# EAGLE design passing-particles (EAGLE 9.6.2)
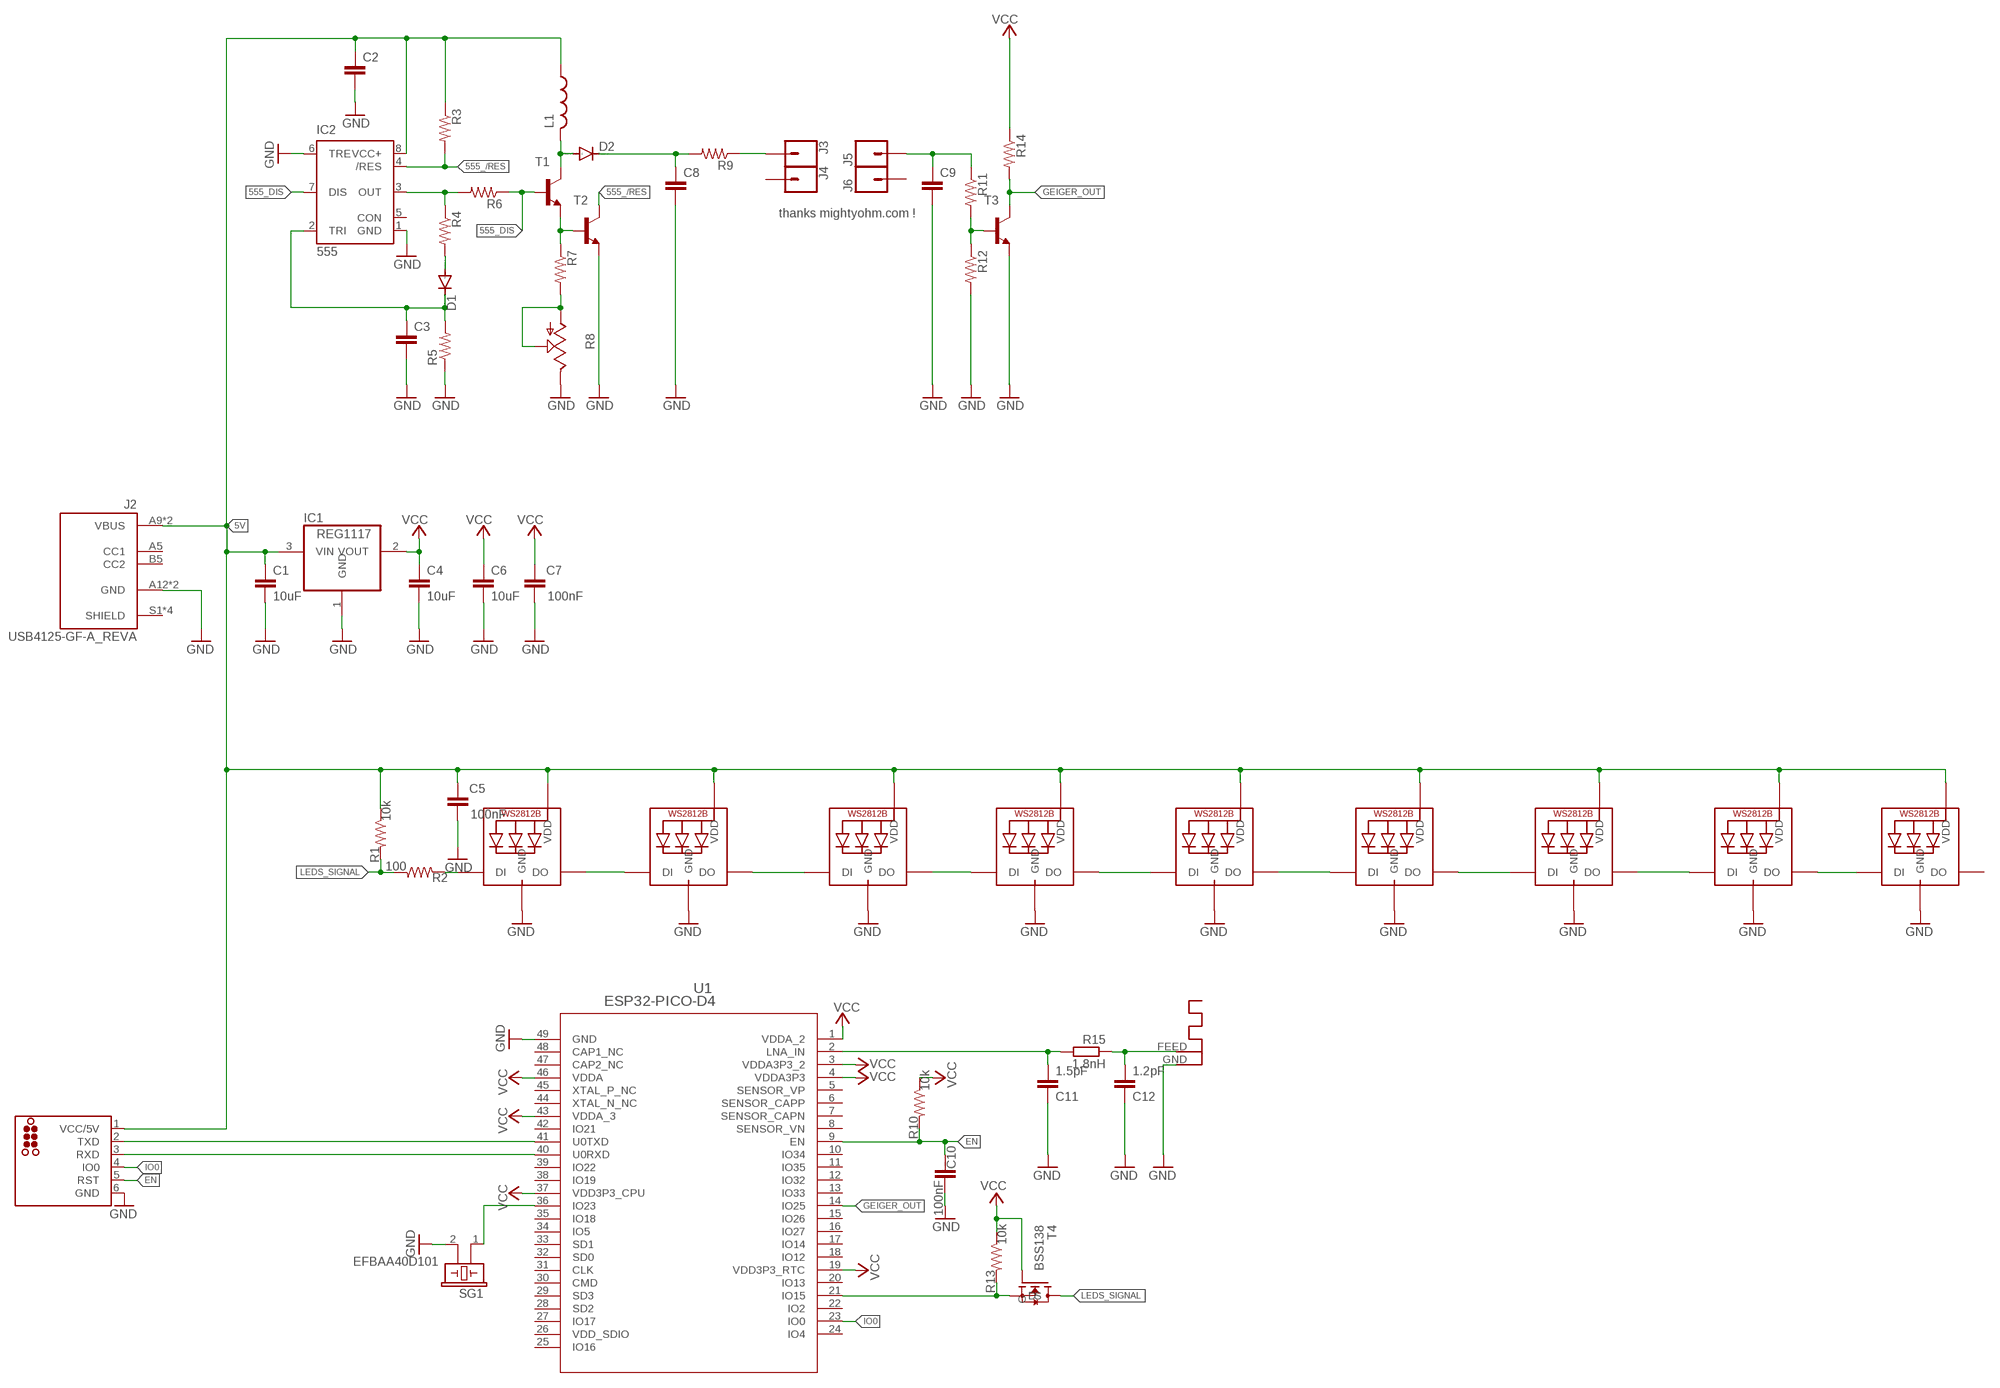
[diagram p0: schematic, sheet 1]

## Parts
ANT1  ANTENNA  [RN-ANT]
C1  10uF  C-EUC0805  [C0805]
C2  C-EUC0402  [C0402]
C3  C-EUC0402  [C0402]
C4  10uF  C-EUC0805  [C0805]
C5  100nF  C-EUC0402  [C0402]
C6  10uF  C-EUC0805  [C0805]
C7  100nF  C-EUC0402  [C0402]
C8  C-EUC0805  [C0805]
C9  C-EUC0402  [C0402]
C10  100nF  C-EUC0402  [C0402]
C11  1.5pF  C-EUC0402  [C0402]
C12  1.2pF  C-EUC0402  [C0402]
D1  DIODE-DO214AA  [DO214AA]
D2  DIODE-DO214AA  [DO214AA]
IC1  REG1117  [SOT223]
IC2  555  555D  [SO08]
J1  TC2030-ESP  [TC2030-MCP]
J2  USB4125-GF-A_REVA  [GCT_USB4125-GF-A_REVA]
J3  CONN_01  [1X01]
J4  CONN_01  [1X01]
J5  CONN_01  [1X01]
J6  CONN_01  [1X01]
L1  L-USL2012C  [L2012C]
LED1  WS2812B5050  [WS2812B]
LED2  WS2812B5050  [WS2812B]
LED3  WS2812B5050  [WS2812B]
LED4  WS2812B5050  [WS2812B]
LED5  WS2812B5050  [WS2812B]
LED6  WS2812B5050  [WS2812B]
LED7  WS2812B5050  [WS2812B]
LED8  WS2812B5050  [WS2812B]
LED9  WS2812B5050  [WS2812B]
R1  10k  R-US_R0402  [R0402]
R2  100  R-US_R0402  [R0402]
R3  R-US_R0402  [R0402]
R4  R-US_R0402  [R0402]
R5  R-US_R0402  [R0402]
R6  R-US_R0402  [R0402]
R7  R-US_R0402  [R0402]
R8  TRIM_US-SM-42/43B  [SM-42/43B]
R9  R-US_R0402  [R0402]
R10  10k  R-US_R0402  [R0402]
R11  R-US_R0402  [R0402]
R12  R-US_R0402  [R0402]
R13  10k  R-US_R0402  [R0402]
R14  R-US_R0402  [R0402]
R15  1.8nH  R-EU_R0402  [R0402]
SG1  EFBAA40D101  [EFBAA40D101]
T1  BC817-NPN-SOT23-BEC  [SOT23-BEC]
T2  BC817-NPN-SOT23-BEC  [SOT23-BEC]
T3  BC817-NPN-SOT23-BEC  [SOT23-BEC]
T4  BSS138  [BSS138]
U1  ESP32-PICO-D4  [ESP32-PICO-D4_EXP]

## Nets
5V: C1.1 C2.1 C5.1 IC1.3(VIN) IC2.8(VCC+) J1.1(VCC/5V) J2.A9(VBUS) J2.B9(VBUS) L1.1 LED1.1-VDD(VDD) LED2.1-VDD(VDD) LED3.1-VDD(VDD) LED4.1-VDD(VDD) LED5.1-VDD(VDD) LED6.1-VDD(VDD) LED7.1-VDD(VDD) LED8.1-VDD(VDD) LED9.1-VDD(VDD) R1.1 R3.1
555_/RES: IC2.4(/RES) R3.2 T2.C
555_DIS: IC2.7(DIS) R6.1 T1.B
EN: C10.2 J1.5(RST) R10.2 U1.9(EN)
GEIGER_OUT: R14.2 T3.C U1.14(IO25)
GND: ANT1.GND C1.2 C2.2 C3.2 C4.2 C5.2 C6.2 C7.2 C8.2 C9.2 C10.1 C11.1 C12.1 IC1.1(GND) IC2.1(GND) IC2.6(TRE) J1.6(GND) J2.A12(GND) J2.B12(GND) LED1.3-GND(GND) LED2.3-GND(GND) LED3.3-GND(GND) LED4.3-GND(GND) LED5.3-GND(GND) LED6.3-GND(GND) LED7.3-GND(GND) LED8.3-GND(GND) LED9.3-GND(GND) R5.1 R8.3(E) R12.2 SG1.2 T2.E T3.E U1.49(GND)
IO0: J1.4(IO0) U1.23(IO0)
LEDS_SIGNAL: R1.2 R2.1 T4.D
N$1: IC2.3(OUT) R4.1 R6.2
N$2: D1.A R4.2
N$3: C3.1 D1.C IC2.2(TRI) R5.2
N$4: R7.1 T1.E T2.B
N$5: D2.A L1.2 T1.C
N$6: R7.2 R8.1(A) R8.2(S)
N$7: C8.1 D2.C R9.2
N$8: J3.1 R9.1
N$9: C9.1 J5.1 R11.1
N$10: R11.2 R12.1 T3.B
N$11: ANT1.FEED C12.2 R15.1
N$12: LED1.2-DOUT(DO) LED2.4-DIN(DI)
N$13: C11.2 R15.2 U1.2(LNA_IN)
N$14: J1.2(TXD) U1.41(U0TXD)
N$15: LED2.2-DOUT(DO) LED3.4-DIN(DI)
N$16: LED3.2-DOUT(DO) LED4.4-DIN(DI)
N$17: LED4.2-DOUT(DO) LED5.4-DIN(DI)
N$18: LED5.2-DOUT(DO) LED6.4-DIN(DI)
N$19: LED6.2-DOUT(DO) LED7.4-DIN(DI)
N$20: LED7.2-DOUT(DO) LED8.4-DIN(DI)
N$21: LED8.2-DOUT(DO) LED9.4-DIN(DI)
N$22: R13.2 T4.S U1.21(IO15)
N$23: SG1.1 U1.36(IO23)
N$24: LED1.4-DIN(DI) R2.2
N$27: J1.3(RXD) U1.40(U0RXD)
VCC: C4.1 C6.1 C7.1 IC1.2(VOUT) R10.1 R13.1 R14.1 T4.G U1.1(VDDA_2) U1.3(VDDA3P3_2) U1.4(VDDA3P3) U1.19(VDD3P3_RTC) U1.37(VDD3P3_CPU) U1.43(VDDA_3) U1.46(VDDA)
Unconnected: IC2.5(CON) J2.A5(CC1) J2.B5(CC2) J2.S1(SHIELD) J2.S2(SHIELD) J2.S3(SHIELD) J2.S4(SHIELD) J4.1 J6.1 LED9.2-DOUT(DO) U1.5(SENSOR_VP) U1.6(SENSOR_CAPP) U1.7(SENSOR_CAPN) U1.8(SENSOR_VN) U1.10(IO34) U1.11(IO35) U1.12(IO32) U1.13(IO33) U1.15(IO26) U1.16(IO27) U1.17(IO14) U1.18(IO12) U1.20(IO13) U1.22(IO2) U1.24(IO4) U1.25(IO16) U1.27(IO17) U1.28(SD2) U1.29(SD3) U1.30(CMD) U1.31(CLK) U1.32(SD0) U1.33(SD1) U1.34(IO5) U1.35(IO18) U1.38(IO19) U1.39(IO22) U1.42(IO21) U1.44(XTAL_N_NC) U1.45(XTAL_P_NC) U1.47(CAP2_NC) U1.48(CAP1_NC)

## Notes on the sheet
- thanks mightyohm.com !

## Power pins joined to a net without a drawn wire
VDD_SDIO: U1.26(VDD_SDIO)

## Library data of the parts
ANT1 = adafruit:ANTENNA
C1-C12 = rcl:C-EU: CAPACITOR, European symbol; SPICEPREFIX: C
D1 D2 = diode:DIODE-: DIODE
IC1 = burr-brown:REG1117: 800mA and 1A Low Dropout (LDO) Positive Regulator 1.8V, 2.5V, 2.85V, 3.3V, 5V, and Adj; MPN: REG1117; OC_FARNELL: 1097566; OC_NEWARK: 14P6981
IC2 = SparkFun-IC-Special-Function:555: General purpose bipolar Timer Datasheet <http://www.sparkfun.com/datasheets/Components/General/ne555.pdf> SparkFun Products SparkFun SparkPunk Sequencer Kit <https://www.sparkfun.com/products/12707> (KIT-12707) Storefront Component: 555 Timer <https://www.sparkfun.com/products/9273> (COM-09273) Two parts valid for production: VFP: IC-11930 (M7555 PTH) VFP: IC-09173 (555 PTH) - Preferred; PROD_ID: NA-XXXXX
J1 = tag-connect:TC2030-ESP
J2 = USB4125-GF-A_REVA:USB4125-GF-A_REVA: USB 2.0 Type C Receptacle, Horizontal, SMT, For Power charging; DESCRIPTION: USB Charge Only Connector Type C Horizontal Receptacle, 3.16mm profile, 6 Pins, Surface mount, Top mount, low cost; MF: Global Connector Technology; MP: USB4125-GF-A; PACKAGE: None; PURCHASE-URL: https://pricing.snapeda.com/search/part/USB4125-GF-A/?ref=eda
J3-J6 = SparkFun-Connectors:CONN_01: Single connection point. Often used as Generic Header-pin footprint for 0.1 inch spaced/style header connections On any of the 0.1 inch spaced packages, you can populate with these: Break Away Headers - Straight <https://www.sparkfun.com/products/116> (PRT-00116) Break Away Male Headers - Right Angle <https://www.sparkfun.com/products/553> (PRT-00553) Female Headers <https://www.sparkfun.com/products/115> (PRT-00115) Break Away Headers - Machine Pin <https://www.sparkfun.com/products/117> (PRT-00117) Break Away Female Headers - Swiss Machine Pin <https://www.sparkfun.com/products/743> (PRT-00743) This device is also useful as a general connection point to wire up your design to another part of your project. Our various solder wires solder well into these plated through hole pads. Hook-Up Wire - Assortment (Stranded, 22 AWG) <https://www.sparkfun.com/products/11375> (PRT-11375) Hook-Up Wire - Assortment (Solid Core, 22 AWG) <https://www.sparkfun.com/products/11367> (PRT-11367) View the entire wire category on our website here <https://www.sparkfun.com/categories/141> Special notes: SMTSO-256-ET is a "flush mount" nut for a 4-40 screw. We mostly use this on specialty testbeds; it is a nice way to connect hardware to your PCB at an adjustable hieght. Also note, the SNAP packages are for using a snappable style connector. We sell a baggie of snaps and they are also used on two LilyPad designs: Snap Assortment - 30 pack (male and female) <https://www.sparkfun.com/products/11347> (DEV-11347) LilyPad Arduino SimpleSnap <https://www.sparkfun.com/products/10941> (DEV-10941) LilyPad SimpleSnap Protoboard <https://www.sparkfun.com/products/10940> (DEV-10940)
L1 = rcl:L-US: INDUCTOR, American symbol; SPICEPREFIX: L
LED1-LED9 = adafruit:WS2812B
R1-R7 R9-R14 = rcl:R-US_: RESISTOR, American symbol; SPICEPREFIX: R
R8 = pot:TRIM_US-: POTENTIOMETER
R15 = rcl:R-EU_: RESISTOR, European symbol; SPICEPREFIX: L
SG1 = buzzer:EFB?: Piezoelectric Acoustic Transducer Source: Panbasonic .. 2SC1685.pdf; OC_FARNELL: unknown; OC_NEWARK: unknown
T1-T3 = transistor-neu-to92:*-NPN-: NPN Transistror
T4 = BSS138:BSS138: BSS138 N-Channel Logic Level Enhancement Mode Field Effect Transistor; AVAILABILITY: Unavailable; DESCRIPTION: N-Channel 50V 220mA (Ta) 360mW (Ta) Surface Mount SOT-23-3; MF: MICROSS/On Semiconductor; MP: BSS138; PACKAGE: TO-236-3 Micross; PRICE: None
U1 = esp32picod4:ESP32-PICO-D4; BUILT_BY: EMA_Cory; COPYRIGHT: Copyright (C) 2018 Accelerated Designs. All rights reserved; DATASHEET: https://www.espressif.com/sites/default/files/documentation/esp32-pico-d4_datasheet_en.pdf; MANUFACTURER_PART_NUMBER: ESP32-PICO-D4; SOURCELIBRARY: Espressif_Systems_2020-04-10; VENDOR: Espressif Systems

## Board
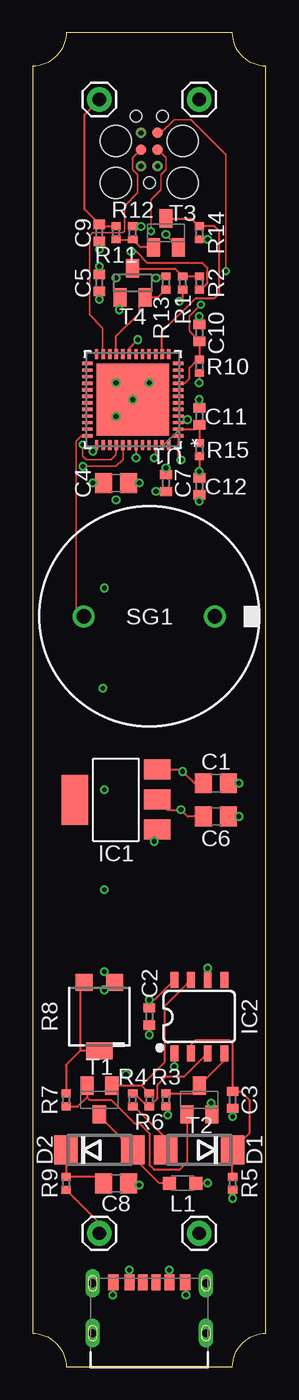
[diagram p1: board, top side]
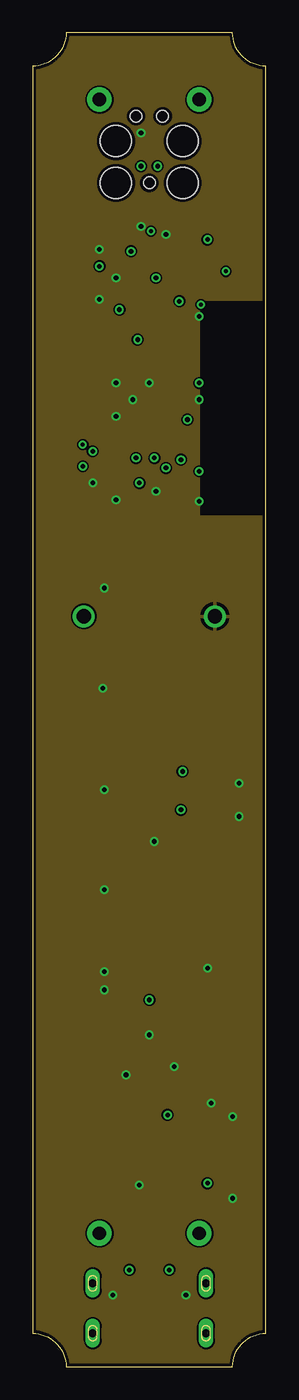
[diagram p2: board, inner layer Route2]
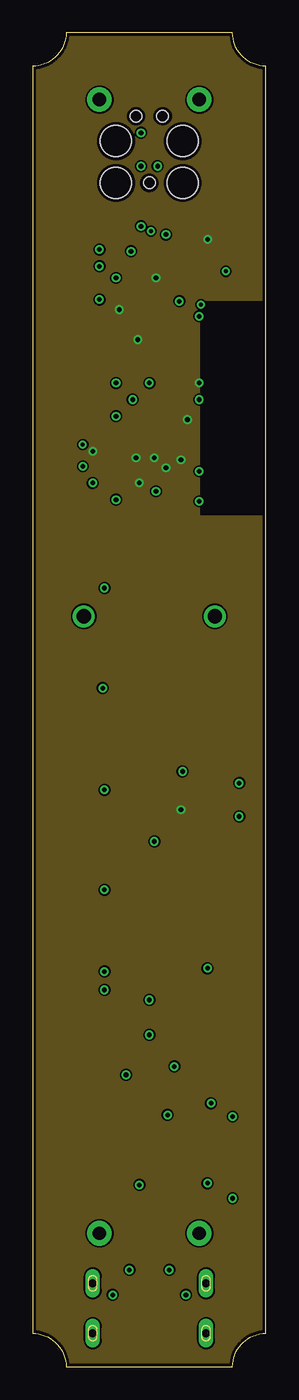
[diagram p3: board, inner layer Route15]
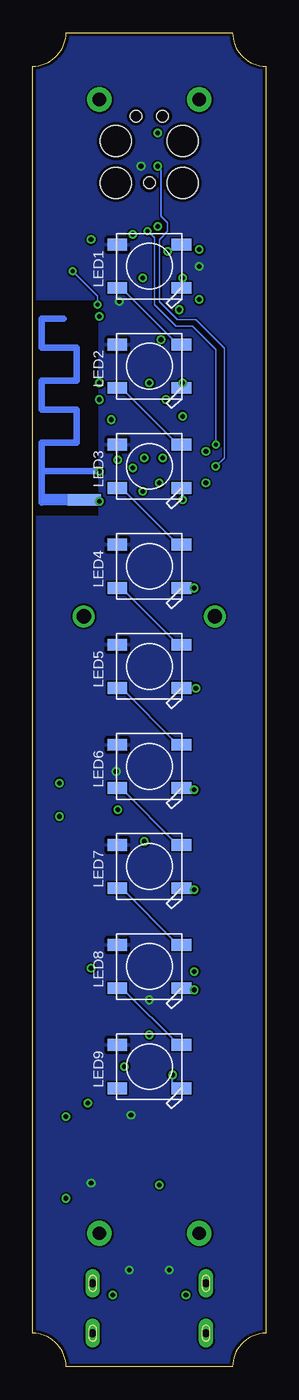
[diagram p4: board, bottom side, seen from below]

Size 17.78 x 101.6 mm. Coordinates in mm from the lower left corner, seen from the top.
Outline: 2.54,0 15.24,0 arc-90 17.78,2.54 17.78,64.77 17.78,81.28 17.78,99.06 arc-90 15.24,101.6 2.54,101.6 arc-90 0,99.06 0,2.54 arc-90 2.54,0
Copper layers (1*2*15*16): Top 0.035mm / dielectric 0.23mm / Route2 0.035mm / dielectric 0.93mm / Route15 0.035mm / dielectric 0.23mm / Bottom 0.035mm
Design rules "MF_Standard_4_Layer": minimum track width 5mil, minimum drill 12mil, track to track 5mil, track to pad 5mil, pad to pad 5mil, via to via 5mil, smd to smd 0mil, copper to edge 10mil, drill to drill 10mil, minimum pad ring 6mil, minimum via ring 6mil, stop-mask expansion 2mil, vias tented up to drill 25mil, thermal gap 10mil

### Footprints (pad centres in the part's own frame; a part is rotated, then mirrored left to right if it is on the bottom)
RN-ANT = smd 0.025 x 0.025: FEED 0,2.159 | smd 2.54 x 0.889: GND -1.143,0
C0805 = smd 1.3 x 1.5: 1 -0.95,0; 2 0.95,0
C0402 = smd 0.7 x 0.9: 1 -0.65,0; 2 0.65,0
DO214AA = smd 1.8 x 2.2: A 2.55,0; C -2.55,0
SOT223 = smd 1.499 x 2.007: 1 -2.261,-3.15; 2 0.025,-3.15; 3 2.311,-3.15 | smd 3.81 x 2.007: 4 0,3.15
SO08 = smd 0.6 x 1.2: 1 -1.905,-2.8; 2 -0.635,-2.8; 3 0.635,-2.8; 4 1.905,-2.8; 5 1.905,2.8; 6 0.635,2.8; 7 -0.635,2.8; 8 -1.905,2.8
TC2030-MCP = smd 0.787 x 0.787: 1 1.27,-0.635; 2 1.27,0.635; 3 2.54,-0.635; 4 2.54,0.635; 5 3.81,-0.635; 6 3.81,0.635 | hole 0.889: 0,0; 5.08,-1.016; 5.08,1.016 | hole 2.375: 0,2.54; 0,-2.54; 3.175,-2.54; 3.175,2.54
GCT_USB4125-GF-A_REVA = smd 0.7 x 1.2: A5 -0.5,0.08; B5 0.5,0.08 | smd 0.76 x 1.2: A9 1.52,0.08; B9 -1.52,0.08 | smd 0.8 x 1.2: A12 2.75,0.08; B12 -2.75,0.08 | drill 0.6 pad 1.1 long: S1 -4.32,0; S2 4.32,0; S3 -4.32,-3.8; S4 4.32,-3.8
1X01 = drill 1.016 pad 1.88: 1 0,0
L2012C = smd 1 x 1: 1 -1,0; 2 1,0
WS2812B = smd 1.5 x 0.9: 1-VDD 2.45,-1.65; 2-DOUT 2.45,1.65; 3-GND -2.45,1.65; 4-DIN -2.45,-1.65
R0402 = smd 0.6 x 0.7: 1 -0.5,0; 2 0.5,0
SM-42/43B = smd 1.3 x 1.3: 1 2.6,1.15; 3 2.6,-1.15 | smd 1.3 x 2: 2 -2.6,0
EFBAA40D101 = drill 1.1 pad 1.676: 1 -5,0; 2 5,0
SOT23-BEC = smd 1 x 1.4: B -0.95,-1.1; C 0,1.1; E 0.95,-1.1
BSS138 = smd 1 x 1.4: D 0,1.1; G -0.95,-1.1; S 0.95,-1.1
ESP32-PICO-D4_EXP = smd 0.787 x 0.254: 1 -3.467,2.75; 2 -3.467,2.25; 3 -3.467,1.75; 4 -3.467,1.25; 5 -3.467,0.75; 6 -3.467,0.25; 7 -3.467,-0.25; 8 -3.467,-0.75; 9 -3.467,-1.25; 10 -3.467,-1.75; 11 -3.467,-2.25; 12 -3.467,-2.75; 25 3.467,-2.75; 26 3.467,-2.25; 27 3.467,-1.75; 28 3.467,-1.25; 29 3.467,-0.75; 30 3.467,-0.25; 31 3.467,0.25; 32 3.467,0.75; 33 3.467,1.25; 34 3.467,1.75; 35 3.467,2.25; 36 3.467,2.75 | smd 0.254 x 0.787: 13 -2.75,-3.467; 14 -2.25,-3.467; 15 -1.75,-3.467; 16 -1.25,-3.467; 17 -0.75,-3.467; 18 -0.25,-3.467; 19 0.25,-3.467; 20 0.75,-3.467; 21 1.25,-3.467; 22 1.75,-3.467; 23 2.25,-3.467; 24 2.75,-3.467; 37 2.75,3.467; 38 2.25,3.467; 39 1.75,3.467; 40 1.25,3.467; 41 0.75,3.467; 42 0.25,3.467; 43 -0.25,3.467; 44 -0.75,3.467; 45 -1.25,3.467; 46 -1.75,3.467; 47 -2.25,3.467; 48 -2.75,3.467 | smd 5.512 x 5.512: 49 0,0

### Placement (x,y rotation side)
ANT1  12.7,66.04 0 bottom
C1  13.97,44.45 0 top
C2  8.89,26.67 270 top
C3  15.24,20.32 270 top
C4  6.35,67.31 180 top
C5  5.08,82.55 270 top
C6  13.97,41.91 0 top
C7  10.16,67.31 270 top
C8  6.35,13.97 0 top
C9  5.08,86.36 270 top
C10  12.7,78.74 270 top
C11  12.7,72.39 270 top
C12  12.7,67.06 90 top
D1  12.7,16.51 180 top
D2  5.08,16.51 0 top
IC1  6.35,43.18 90 top
IC2  12.7,26.67 0 top
J1  8.89,90.17 90 top
J2  8.89,6.35 0 top
J3  5.08,10.16 270 top
J4  12.7,96.52 270 top
J5  5.08,96.52 270 top
J6  12.7,10.16 270 top
L1  11.43,13.97 180 top
LED1  8.89,83.82 180 bottom
LED2  8.89,76.2 180 bottom
LED3  8.89,68.58 180 bottom
LED4  8.89,60.96 180 bottom
LED5  8.89,53.34 180 bottom
LED6  8.89,45.72 180 bottom
LED7  8.89,38.1 180 bottom
LED8  8.89,30.48 180 bottom
LED9  8.89,22.86 180 bottom
R1  11.43,82.55 90 top
R2  12.7,82.55 270 top
R3  10.16,20.32 90 top
R4  7.62,20.32 270 top
R5  15.24,13.97 90 top
R6  8.89,20.32 270 top
R7  2.54,20.32 90 top
R8  5.08,26.67 90 top
R9  2.54,13.97 90 top
R10  12.7,76.2 90 top
R11  6.35,86.36 270 top
R12  7.62,86.36 90 top
R13  10.16,82.55 270 top
R14  12.7,86.36 90 top
R15  12.7,69.85 90 top
SG1  8.89,57.15 0 top
T1  5.08,20.32 180 top
T2  12.7,20.32 0 top
T3  10.16,86.36 0 top
T4  7.62,82.55 0 top
U1  7.62,73.66 180 top

### Tracks (layer width: path | path; a pad name or v marks a point on that pad's centre or on a via)
5V  (via drill 0.35)
  Top 0.152: C5.1 v5.08,83.82 | IC2.8 9.27,27.94 v8.89,27.94 C2.1 | R3.1 10.29,19.69 v10.29,19.18 | L1.1 v13.34,13.97 | J2.B9 v7.37,7.36 v7.37,7.37 | J2.A9 v10.41,7.36 v10.41,7.37 | IC1.3 11.28,45.49 v11.43,45.34 12.32,44.45 C1.1 | R1.1 11.43,81.41 v11.18,81.15
  other vias: 9.53,91.44
  pour Bottom: 0,0 17.78,0 17.78,64.77 12.7,64.77 12.7,81.28 17.78,81.28 17.78,86.36 17.78,101.6 0,101.6
555_/RES
  Top 0.152: IC2.4 14.61,23.32 T2.C 12.7,21.34 12.18,20.82 R3.2
555_DIS
  Top 0.152: T1.B 8.29,21.42 | 8.29,21.42 R6.1 | IC2.7 10.03,27.44 10.03,23.16 8.29,21.42
EN  (via drill 0.3)
  Top 0.127: J1.5 9.78,93.98 10.79,95 12.06,95 14.73,92.33 v14.73,83.44 | v12.83,80.9 11.94,80.01 11.94,78.87 12.7,78.11 C10.2
  Top 0.152: C10.2 R10.2 12.56,76.7 11.94,76.07 11.94,75.25 11.6,74.91 U1.9
  Bottom 0.127: v14.73,83.44 12.83,81.53 v12.83,80.9
GEIGER_OUT
  Top 0.152: T3.C 12.1,87.46 R14.2 | R14.2 | U1.14 9.87,78.83 12.45,81.41 13.84,81.41 14.22,81.79 14.22,86.49 13.85,86.86 R14.2
GND  (via drill 0.35)
  Top 0.152: v12.7,65.91 C12.1 | C11.1 v12.7,73.66 | C10.1 v12.7,80.01 | v8.26,86.87 R12.2 | C9.2 v5.08,85.09 | T3.E 11.11,85.28 v10.16,86.23 | C5.2 v5.08,81.28 | v8.89,74.93 U1.49 v6.35,72.39 | C4.2 v4.57,67.31 | C7.2 10.14,66.67 v9.4,66.67 | R8.3 5.46,30.04 v5.46,30.1 | IC2.6 v13.34,30.35 | C2.2 v8.89,25.27 | IC2.1 v10.79,22.86 | T2.E 13.65,20 v13.59,20.07 | C3.2 v15.24,19.05 | R5.1 v15.24,12.83 | J2.A12 11.64,5.5 v11.68,5.46 | J2.B12 6.14,5.5 v6.1,5.46 | C1.2 v15.75,44.45 | C6.2 v15.75,41.91 | IC1.1 9.5,40.23 v9.27,40.01 | C8.2 8,13.97 v8.13,13.84
  Bottom 0.152: ANT1.GND 12.83,66.04 v12.7,65.91 | LED1.3-GND 6.44,82.84 v6.35,82.93 | LED2.3-GND 6.35,74.64 v6.35,74.93 | LED4.3-GND v5.46,59.31 | LED5.3-GND v5.33,51.69 | LED6.3-GND 6.31,43.94 v5.46,43.94 | LED7.3-GND 5.59,36.45 v5.46,36.32 | LED8.3-GND 6.31,28.7 v5.46,28.7 | LED9.3-GND 6.82,21.21 7.11,21.5 v7.11,22.23 | LED3.3-GND 6.35,66.84 v6.35,66.04
  other vias: 8.26,93.98 7.62,73.66
  pour Route2: 0,0 17.78,0 17.78,64.77 12.7,64.77 12.7,81.28 17.78,81.28 17.78,86.36 17.78,105.41 0,105.41
IO0
  Top 0.127: J1.4 7.62,92.08 7.62,91.19 8,90.81 8,89.41 6.99,88.39 6.99,86.49 6.86,86.36 4.57,86.36 4.32,86.11 4.32,80.14 5.33,79.12 5.33,77.22 U1.23
LEDS_SIGNAL
  Top 0.152: R2.1 R1.2 10.83,83.65 T4.D
N$1
  Top 0.152: IC2.3 11.56,22.1 10.17,22.1 9.53,21.45 9.53,20.45 R6.2 8.75,19.82 7.75,20.82 R4.1
N$2
  Top 0.152: D1.A 10.15,17.41 7.74,19.82 R4.2
N$3
  Top 0.152: R5.2 D1.C 16.51,17.77 16.51,20.32 15.86,20.97 C3.1 15.24,24.64 14.99,24.89 12.45,24.89 12.06,24.51 IC2.2
N$4
  Top 0.152: R7.1 3.44,19.82 4.13,20.51 | T1.E 4.13,20.51 | T2.B 11.75,15.56 11.18,14.99 9.27,14.99 8.89,15.37 8.89,17.78 8.13,18.54 7.75,18.54 5.97,20.32 4.32,20.32 4.13,20.51
N$5
  Top 0.152: T1.C 5.08,19.06 D2.A 7.63,16 9.66,13.97 L1.2
N$6
  Top 0.152: R8.2 3.62,24.07 | 3.62,24.07 2.54,22.99 R7.2 | R8.1 3.62,28.96 3.62,24.07
N$7
  Top 0.152: D2.C R9.2 4.9,14.47 C8.1
N$8
  Top 0.152: R9.1 5.08,10.93 J3.1
N$9
  Top 0.152: R11.1 5.23,86.86 C9.1 3.94,88.15 3.94,95.38 J5.1
N$10
  Top 0.152: R11.2 R12.1 8.22,85.26 T3.B
N$11  (via drill 0.35)
  Top 0.152: R15.1 ANT1.FEED C12.2
  other vias: 12.7,68.2
N$12
  Bottom 0.152: LED2.4-DIN 6.69,77.85 11.01,82.17 LED1.2-DOUT
N$13
  Top 0.152: R15.2 C11.2 12.37,71.41 U1.2
N$14  (via drill 0.35)
  Top 0.127: v3.82,68.58 6.35,68.58 6.87,69.1 U1.41
  Bottom 0.127: J1.2 8,91.19 8,87.63 7.49,87.12 7.49,86.49 8.13,85.85 8.13,81.13 6.75,79.76 5.33,79.76 3.17,77.6 3.17,69.22 v3.82,68.58
  other vias: 8.26,91.44
N$15
  Bottom 0.152: LED3.4-DIN 6.69,70.23 11.01,74.55 LED2.2-DOUT
N$16
  Bottom 0.152: LED4.4-DIN 6.69,62.61 11.01,66.93 LED3.2-DOUT
N$17
  Bottom 0.152: LED5.4-DIN 6.69,54.99 11.01,59.31 LED4.2-DOUT
N$18
  Bottom 0.152: LED6.4-DIN 6.69,47.37 11.01,51.69 LED5.2-DOUT
N$19
  Bottom 0.152: LED6.2-DOUT 11.05,44.07 6.73,39.75 LED7.4-DIN
N$20
  Bottom 0.152: LED8.4-DIN 6.69,32.13 11.01,36.45 LED7.2-DOUT
N$21
  Bottom 0.152: LED9.4-DIN 6.64,24.51 10.96,28.83 LED8.2-DOUT
N$22
  Top 0.152: R13.2 9.56,81.45 T4.S 8.13,81.01 8.13,80.26 6.37,78.51 U1.21
N$23
  Top 0.127: U1.36 4.06,70.87 3.68,70.87 3.3,70.48 3.3,57.66 3.81,57.15 SG1.1
N$24  (via drill 0.35)
  Top 0.152: R2.2 12.84,82.05 13.34,82.55 13.34,83.69 12.95,84.07 8.76,84.07 7.87,84.96 v7.49,84.96
  Bottom 0.152: v7.49,84.96 7.24,84.96 6.73,85.47 LED1.4-DIN
N$27  (via drill 0.3)
  Top 0.127: v3.81,70.23 3.81,69.34 4.06,69.09 5.97,69.09 6.35,69.47 6.35,70.1 U1.40 | v9.02,86.49 9.02,88.9 9.78,89.66 9.78,90.81 10.16,91.19 10.16,92.08 J1.3
  Bottom 0.127: v3.81,70.23 3.81,77.47 5.59,79.25 6.86,79.25 8.51,80.9 8.51,85.98 v9.02,86.49
VCC  (via drill 0.35)
  Top 0.152: R10.1 v12.7,74.93 | R14.1 13.33,85.86 v13.34,85.85 | R13.1 9.52,83.05 v9.4,82.93 | T4.G 6.67,80.58 v6.6,80.52 | U1.19 7.37,77.6 v8,78.23 | C4.1 v8.13,67.31 | C7.1 v10.16,68.45 | U1.46 9.37,69.31 v9.27,69.22 | U1.43 v7.87,69.22 | U1.37 4.87,69.89 4.7,69.72 v4.57,69.72 | IC1.2 10.29,42.42 v11.3,42.42 11.81,41.91 C6.1 | U1.1 11.09,69.39 11.3,69.17 v11.3,69.09 | U1.3 11.6,71.91 11.8,72.11 v11.8,72.14 11.52,72.41 U1.4
  pour Route15: 0,0 17.78,0 17.78,64.77 12.7,64.77 12.7,81.28 17.78,81.28 17.78,105.41 0,105.41